# Altium schematic sheet Sheet_1_2025-10-18.schdoc
size 243 x 180 mm
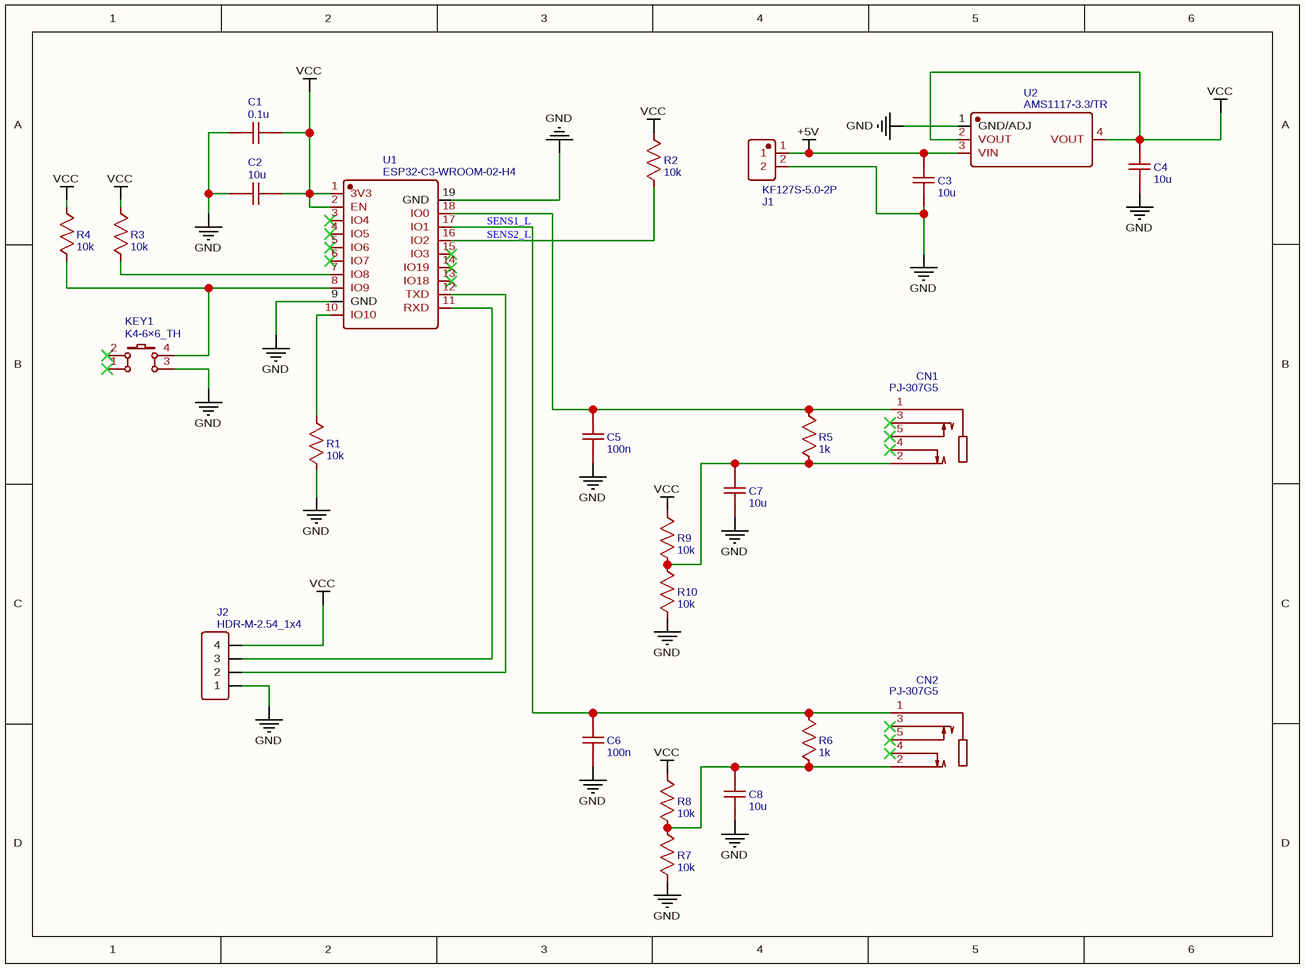
[diagram p0: Sheet_1_2025-10-18.schdoc]

## Parts
C1  0.1u  [C0805]
C2  10u  [C0805]
C3  10u  [C0805]
C4  10u  [C0805]
C5  100n  [C0805]
C6  100n  [C0805]
C7  10u  [C0805]
C8  10u  [C0805]
CN1  PJ-307G5  [AUDIO-TH_PJ-307G5]
CN2  PJ-307G5  [AUDIO-TH_PJ-307G5]
J1  KF127S-5.0-2P  [CONN-TH_2P-P5.00_KEFA_KF127S-5.0-2P]
J2  HDR-M-2.54_1x4  [HDR-M-2.54_1X4]
KEY1  K4-6×6_TH  [KEY-TH_4P-L6.0-W6.0-P4.50-LS6.5]
R1  10k  [R0805]
R2  10k  [R0805]
R3  10k  [R0805]
R4  10k  [R0805]
R5  1k  [R0805]
R6  1k  [R0805]
R7  10k  [R0805]
R8  10k  [R0805]
R9  10k  [R0805]
R10  10k  [R0805]
U1  ESP32-C3-WROOM-02-H4  [WIFIM-SMD_18P-L20.0-W18.0-P1.50]
U2  AMS1117-3.3/TR  [SOT-223_L6.5-W3.5-P2.30-LS7.0-BR]

## Nets
+5V: C3.2 J1.1 U2.3(VIN)
GND: C1.1 C2.1 C3.1 C4.1 C5.1 C6.1 C7.1 C8.1 J1.2 J2.1 KEY1.3 R1.1 R7.1 R10.1 U1.9(GND) U1.19(GND) U2.1(GND/ADJ)
VCC: C1.2 C2.2 C4.2 J2.4 R2.2 R3.2 R4.2 R8.2 R9.2 U1.1(3V3) U1.2(EN) U2.2(VOUT) U2.4(VOUT)
SENS1_L: C5.2 CN1.1 R5.2 U1.18(IO0)
SENS2_L: C6.2 CN2.1 R6.2 U1.17(IO1)
NetC7_2: C7.2 CN1.2 R5.1 R9.1 R10.2
NetC8_2: C8.2 CN2.2 R6.1 R7.2 R8.1
NetJ2_2: J2.2 U1.12(TXD)
NetJ2_3: J2.3 U1.11(RXD)
NetKEY1_4: KEY1.4 R4.1 U1.8(IO9)
NetR1_2: R1.2 U1.10(IO10)
NetR2_1: R2.1 U1.16(IO2)
NetR3_1: R3.1 U1.7(IO8)

Not connected (* = marked no-connect by the designer): CN1 3* 4* 5*; CN2 3* 4* 5*; KEY1 1* 2*; U1 3(IO4)* 4(IO5)* 5(IO6)* 6(IO7)* 13(IO18)* 14(IO19)* 15(IO3)*

## Library data of the parts
C1 = 0.1u: nameAlias: Value(F); Contributor: LCEDA_Lib; spicePre: C; spiceSymbolName: C_0805_US
C2-C4 C7 C8 = 10u: nameAlias: Value(F); Contributor: LCEDA_Lib; spicePre: C; spiceSymbolName: C_0805_US
C5 C6 = 100n: nameAlias: Value(F); Contributor: LCEDA_Lib; spicePre: C; spiceSymbolName: C_0805_US
CN1 CN2 = PJ-307G5: Manufacturer: XKB Connectivity(中国星坤); Contributor: LCSC; Supplier: LCSC; Supplier Part: C381128; Manufacturer Part: PJ-307G5; JLCPCB Part Class: Extended Part; spicePre: C; spiceSymbolName: PJ-307G5
J1 = KF127S-5.0-2P: Manufacturer: KEFA(科发); Contributor: lcsc; Supplier: LCSC; Supplier Part: C2974917; Manufacturer Part: KF127S-5.0-2P; JLCPCB Part Class: Extended Part; spicePre: U; spiceSymbolName: KF127S-5.0-2P
J2 = HDR-M-2.54_1x4: Contributor: LCEDA_Lib; Supplier Part: C124378; Supplier: LCSC; spicePre: J; spiceSymbolName: HDR-M-2.54_1x4
KEY1 = K4-6×6_TH: Manufacturer: 韩国韩荣; Manufacturer Part: K2-1102DP-E4SW-04; Contributor: LCEDA_Lib; Supplier: LCSC; Supplier Part: C136684; spicePre: K; spiceSymbolName: K4-6×6_TH
R1-R4 R7-R10 = 10k: nameAlias: Value(Ω); Contributor: LCEDA_Lib; spicePre: R; spiceSymbolName: R_0805_US
R5 R6 = 1k: nameAlias: Value(Ω); Contributor: LCEDA_Lib; spicePre: R; spiceSymbolName: R_0805_US
U1 = ESP32-C3-WROOM-02-H4: Manufacturer: ESPRESSIF(乐鑫); Contributor: LCSC; Supplier: LCSC; Supplier Part: C2944070; Manufacturer Part: ESP32-C3-WROOM-02-H4; JLCPCB Part Class: Extended Part; spicePre: U; spiceSymbolName: ESP32-C3-WROOM-02-H4
U2 = AMS1117-3.3/TR: Manufacturer: HGSEMI(华冠); Contributor: lcsc; Supplier: LCSC; Supplier Part: C22461603; Manufacturer Part: AMS1117-3.3/TR; spicePre: U; spiceSymbolName: AMS1117-3.3/TR